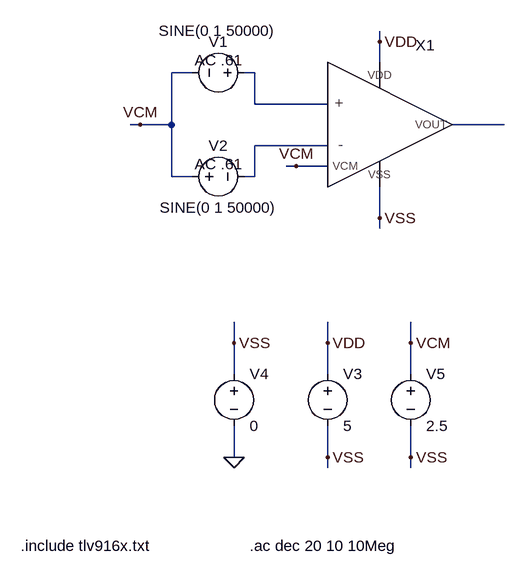
[diagram p0: schematic tb_dac_filter.asc]
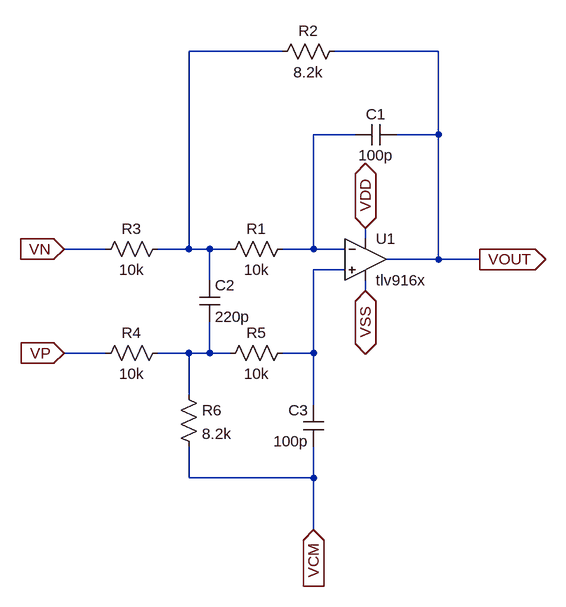
[diagram p1: sub-circuit dac_filter.asc]
tb_dac_filter.asc, the LTspice schematic file:
Version 4.1
SHEET 1 880 904
WIRE 192 64 192 48
WIRE 192 96 192 64
WIRE -96 112 -128 112
WIRE 0 112 -16 112
WIRE 0 160 0 112
WIRE 112 160 0 160
WIRE -176 192 -192 192
WIRE -128 192 -128 112
WIRE -128 192 -176 192
WIRE 384 192 304 192
WIRE 112 224 0 224
WIRE 64 256 48 256
WIRE 112 256 64 256
WIRE -128 272 -128 192
WIRE -96 272 -128 272
WIRE 0 272 0 224
WIRE 0 272 -16 272
WIRE 192 336 192 288
WIRE 192 352 192 336
WIRE -32 528 -32 496
WIRE 112 528 112 496
WIRE 240 528 240 496
WIRE -32 576 -32 528
WIRE 112 576 112 528
WIRE 240 576 240 528
WIRE -32 704 -32 656
WIRE 112 704 112 656
WIRE 240 704 240 656
WIRE 112 720 112 704
WIRE 240 720 240 704
FLAG -176 192 VCM
FLAG -32 704 0
FLAG -32 528 VSS
FLAG 112 704 VSS
FLAG 112 528 VDD
FLAG 240 704 VSS
FLAG 240 528 VCM
FLAG 192 64 VDD
FLAG 64 256 VCM
FLAG 192 336 VSS
SYMBOL dac_filter 176 96 R0
WINDOW 0 86 -11 Bottom 2
SYMATTR InstName X1
SYMBOL voltage 0 112 R90
WINDOW 0 -32 56 VBottom 2
WINDOW 3 -80 58 VTop 2
WINDOW 123 -4 56 VBottom 2
WINDOW 39 0 0 Left 0
SYMATTR InstName V1
SYMATTR Value SINE(0 1 50000)
SYMATTR Value2 AC .61
SYMBOL voltage -112 272 R270
WINDOW 0 32 56 VTop 2
WINDOW 3 -32 56 VBottom 2
WINDOW 123 4 56 VTop 2
WINDOW 39 0 0 Left 0
SYMATTR InstName V2
SYMATTR Value SINE(0 1 50000)
SYMATTR Value2 AC .61
SYMBOL voltage 112 560 R0
WINDOW 123 0 0 Left 0
WINDOW 39 0 0 Left 0
SYMATTR InstName V3
SYMATTR Value 5
SYMBOL voltage -32 560 R0
WINDOW 123 0 0 Left 0
WINDOW 39 0 0 Left 0
SYMATTR InstName V4
SYMATTR Value 0
SYMBOL voltage 240 560 R0
WINDOW 123 0 0 Left 0
WINDOW 39 0 0 Left 0
SYMATTR InstName V5
SYMATTR Value 2.5
TEXT -360 840 Left 2 !.include tlv916x.txt
TEXT -8 840 Left 2 !.ac dec 20 10 10Meg

dac_filter.asc, the sub-circuit schematic file:
Version 4.1
SHEET 1 880 680
WIRE 32 -192 -112 -192
WIRE 272 -192 112 -192
WIRE 144 -64 80 -64
WIRE 272 -64 272 -192
WIRE 272 -64 208 -64
WIRE 160 96 160 80
WIRE -240 112 -304 112
WIRE -112 112 -112 -192
WIRE -112 112 -160 112
WIRE -80 112 -112 112
WIRE -48 112 -80 112
WIRE 80 112 80 -64
WIRE 80 112 32 112
WIRE 128 112 80 112
WIRE 272 128 272 -64
WIRE 272 128 192 128
WIRE 336 128 272 128
WIRE 128 144 80 144
WIRE -80 160 -80 112
WIRE 160 176 160 160
WIRE -240 272 -304 272
WIRE -112 272 -160 272
WIRE -80 272 -80 224
WIRE -80 272 -112 272
WIRE -48 272 -80 272
WIRE 80 272 80 144
WIRE 80 272 32 272
WIRE -112 336 -112 272
WIRE 80 352 80 272
WIRE -112 464 -112 416
WIRE 80 464 80 416
WIRE 80 464 -112 464
WIRE 80 544 80 464
FLAG 80 544 VCM
IOPIN 80 544 In
FLAG -304 272 VP
IOPIN -304 272 In
FLAG -304 112 VN
IOPIN -304 112 In
FLAG 336 128 VOUT
IOPIN 336 128 Out
FLAG 160 176 VSS
IOPIN 160 176 BiDir
FLAG 160 80 VDD
IOPIN 160 80 BiDir
SYMBOL OpAmps\\opamp2 160 64 R0
SYMATTR InstName U1
SYMATTR Value tlv916x
SYMBOL res 48 96 R90
WINDOW 0 0 56 VBottom 2
WINDOW 3 32 56 VTop 2
SYMATTR InstName R1
SYMATTR Value 10k
SYMBOL cap 208 -80 R90
WINDOW 0 0 32 VBottom 2
WINDOW 3 32 32 VTop 2
SYMATTR InstName C1
SYMATTR Value 100p
SYMBOL res 128 -208 R90
WINDOW 0 0 56 VBottom 2
WINDOW 3 32 56 VTop 2
SYMATTR InstName R2
SYMATTR Value 8.2k
SYMBOL cap -96 160 R0
SYMATTR InstName C2
SYMATTR Value 220p
SYMBOL res -144 96 R90
WINDOW 0 0 56 VBottom 2
WINDOW 3 32 56 VTop 2
SYMATTR InstName R3
SYMATTR Value 10k
SYMBOL res -144 256 R90
WINDOW 0 0 56 VBottom 2
WINDOW 3 32 56 VTop 2
SYMATTR InstName R4
SYMATTR Value 10k
SYMBOL res 48 256 R90
WINDOW 0 0 56 VBottom 2
WINDOW 3 32 56 VTop 2
SYMATTR InstName R5
SYMATTR Value 10k
SYMBOL cap 96 416 R180
WINDOW 0 24 56 Left 2
WINDOW 3 24 8 Left 2
SYMATTR InstName C3
SYMATTR Value 100p
SYMBOL res -128 320 R0
SYMATTR InstName R6
SYMATTR Value 8.2k

The netlist it stands for:
* tb_dac_filter.asc
X§X1 VCM N003 N001 VDD N002 VSS dac_filter
V1 N001 VCM SINE(0 1 50000) AC .61
V2 VCM N003 SINE(0 1 50000) AC .61
V3 VDD VSS 5
V4 VSS 0 0
V5 VCM VSS 2.5

* block symbol definitions
.subckt dac_filter VCM VN VP VDD VOUT VSS
X§U1 N003 N002 VDD VSS VOUT tlv916x  ; pins In+ In- V+ V- OUT
R1 N002 N001 10k
C1 VOUT N002 100p
R2 VOUT N001 8.2k
C2 N001 N004 220p
R3 N001 VN 10k
R4 N004 VP 10k
R5 N003 N004 10k
C3 VCM N003 100p
R6 N004 VCM 8.2k
.ends dac_filter

.include tlv916x.txt
.ac dec 20 10 10Meg
.backanno
.end